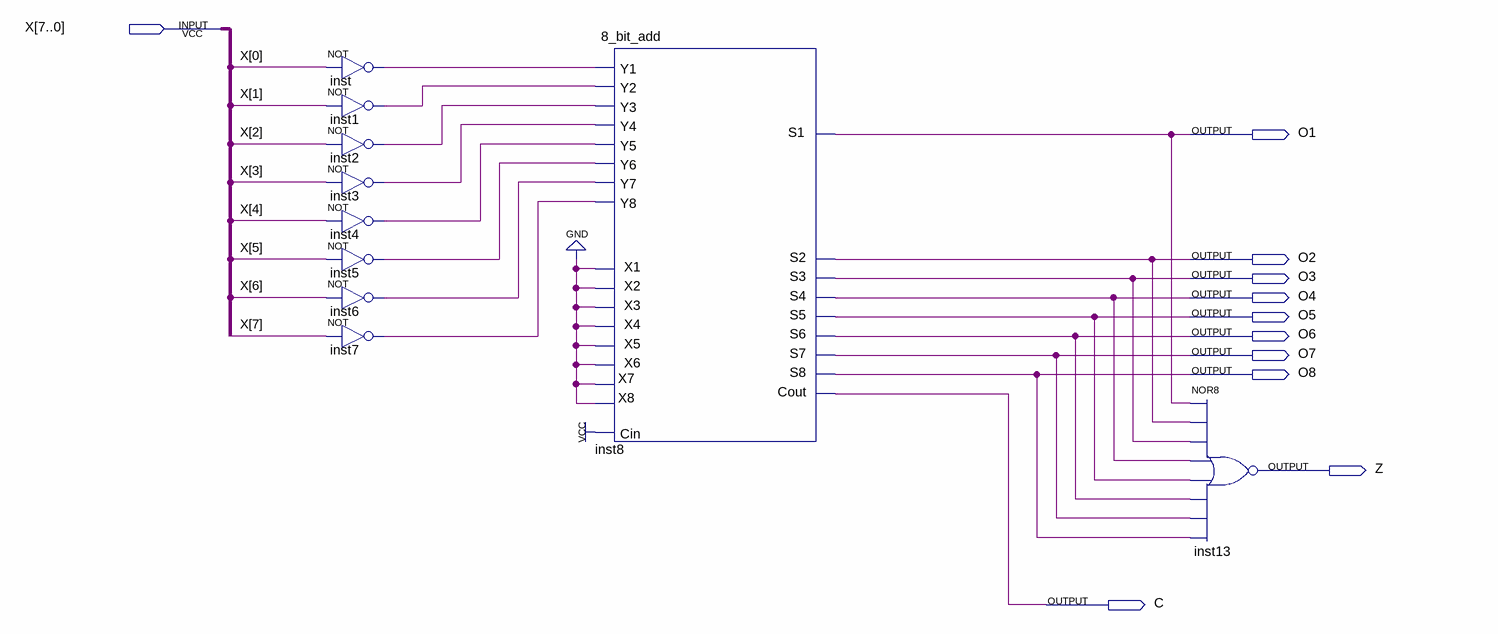
[diagram p0: schematic sheet]
// Quartus schematic 2s_Comp.bdf as structural Verilog: 10 symbols, 11 pins
module \2s_Comp  (
  input  [7:0] X,
  output O1,
  output O2,
  output O3,
  output O4,
  output O5,
  output O6,
  output O7,
  output O8,
  output Z,
  output C
);

  wire inst1_out, inst2_out, inst3_out, inst4_out, inst5_out, inst6_out, inst7_out, inst_out;

  not inst (inst_out, X[0]);
  not inst1 (inst1_out, X[1]);
  not inst2 (inst2_out, X[2]);
  not inst3 (inst3_out, X[3]);
  not inst4 (inst4_out, X[4]);
  not inst5 (inst5_out, X[5]);
  not inst6 (inst6_out, X[6]);
  not inst7 (inst7_out, X[7]);
  \8_bit_add  inst8 (
    .Y1(inst_out), .X1(1'b0), .X2(1'b0), .X3(1'b0), .X4(1'b0), .Y2(inst1_out), .Y3(inst2_out),
    .Y4(inst3_out), .X5(1'b0), .Y5(inst4_out), .X6(1'b0), .Y6(inst5_out), .X7(1'b0), .Y7(inst6_out),
    .X8(1'b0), .Y8(inst7_out), .Cin(1'b1), .Cout(C), .S1(O1), .S2(O2), .S3(O3), .S4(O4), .S5(O5), .S6(O6),
    .S7(O7), .S8(O8));
  nor inst13 (Z, O1, O2, O3, O4, O5, O6, O7, O8);
endmodule
